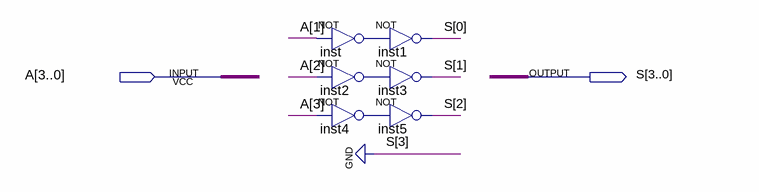
[diagram p0: schematic sheet]
// Quartus schematic DIVISOR4.bdf as structural Verilog: 6 symbols, 2 pins
module DIVISOR4 (
  input  [3:0] A,
  output [3:0] S
);

  wire inst2_out, inst4_out, inst_out;

  not inst (inst_out, A[1]);
  not inst2 (inst2_out, A[2]);
  not inst4 (inst4_out, A[3]);
  not inst1 (S[0], inst_out);
  not inst3 (S[1], inst2_out);
  not inst5 (S[2], inst4_out);

  assign S[3] = 1'b0;
endmodule
